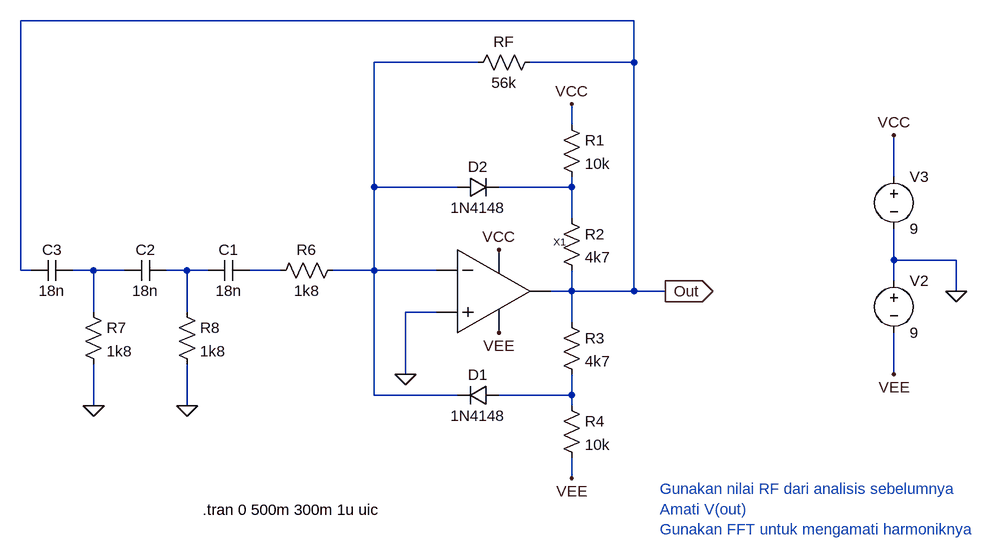
[diagram p0: schematic Perc-4-2-PhaseShifterIWithLimiter.asc]
Perc-4-2-PhaseShifterIWithLimiter.asc, the LTspice schematic file:
Version 4
SHEET 1 1076 680
WIRE 320 -128 -624 -128
WIRE 80 -64 -80 -64
WIRE 320 -64 320 -128
WIRE 320 -64 160 -64
WIRE 224 32 224 0
WIRE 720 112 720 48
WIRE -80 128 -80 -64
WIRE 48 128 -80 128
WIRE 224 128 224 112
WIRE 224 128 112 128
WIRE 224 176 224 128
WIRE 720 240 720 192
WIRE 816 240 720 240
WIRE -624 256 -624 -128
WIRE -608 256 -624 256
WIRE -512 256 -544 256
WIRE -464 256 -512 256
WIRE -368 256 -400 256
WIRE -336 256 -368 256
WIRE -224 256 -272 256
WIRE -80 256 -80 128
WIRE -80 256 -144 256
WIRE 16 256 -80 256
WIRE 720 272 720 240
WIRE 224 288 224 256
WIRE 224 288 192 288
WIRE 320 288 320 -64
WIRE 320 288 224 288
WIRE 368 288 320 288
WIRE 816 288 816 240
WIRE -512 320 -512 256
WIRE -368 320 -368 256
WIRE 16 320 -32 320
WIRE 224 336 224 288
WIRE -32 416 -32 320
WIRE 720 416 720 352
WIRE -80 448 -80 256
WIRE 48 448 -80 448
WIRE 224 448 224 416
WIRE 224 448 112 448
WIRE -512 464 -512 400
WIRE -368 464 -368 400
WIRE 224 464 224 448
WIRE 224 576 224 544
FLAG 224 0 VCC
FLAG 224 576 VEE
FLAG -32 416 0
FLAG 720 416 VEE
FLAG 112 352 VEE
FLAG 720 48 VCC
FLAG 816 288 0
FLAG 112 224 VCC
FLAG -512 464 0
FLAG -368 464 0
FLAG 368 288 Out
IOPIN 368 288 Out
SYMBOL res 208 16 R0
SYMATTR InstName R1
SYMATTR Value 10k
SYMBOL res 208 160 R0
SYMATTR InstName R2
SYMATTR Value 4k7
SYMBOL res 208 320 R0
SYMATTR InstName R3
SYMATTR Value 4k7
SYMBOL res 208 448 R0
SYMATTR InstName R4
SYMATTR Value 10k
SYMBOL res 176 -80 R90
WINDOW 0 0 56 VBottom 2
WINDOW 3 32 56 VTop 2
SYMATTR InstName RF
SYMATTR Value 56k
SYMBOL res -128 240 R90
WINDOW 0 0 56 VBottom 2
WINDOW 3 32 56 VTop 2
SYMATTR InstName R6
SYMATTR Value 1k8
SYMBOL diode 112 432 R90
WINDOW 0 0 32 VBottom 2
WINDOW 3 32 32 VTop 2
SYMATTR InstName D1
SYMATTR Value 1N4148
SYMBOL diode 48 112 M90
WINDOW 0 0 32 VBottom 2
WINDOW 3 32 32 VTop 2
SYMATTR InstName D2
SYMATTR Value 1N4148
SYMBOL voltage 720 256 R0
WINDOW 123 0 0 Left 0
WINDOW 39 0 0 Left 0
SYMATTR InstName V2
SYMATTR Value 9
SYMBOL voltage 720 96 R0
WINDOW 123 0 0 Left 0
WINDOW 39 0 0 Left 0
SYMATTR InstName V3
SYMATTR Value 9
SYMBOL cap -272 240 R90
WINDOW 0 0 32 VBottom 2
WINDOW 3 32 32 VTop 2
SYMATTR InstName C1
SYMATTR Value 18n
SYMBOL cap -400 240 R90
WINDOW 0 0 32 VBottom 2
WINDOW 3 32 32 VTop 2
SYMATTR InstName C2
SYMATTR Value 18n
SYMBOL cap -544 240 R90
WINDOW 0 0 32 VBottom 2
WINDOW 3 32 32 VTop 2
SYMATTR InstName C3
SYMATTR Value 18n
SYMBOL res -528 304 R0
SYMATTR InstName R7
SYMATTR Value 1k8
SYMBOL res -384 304 R0
SYMATTR InstName R8
SYMATTR Value 1k8
SYMBOL Opampku 96 288 R0
SYMATTR InstName X1
TEXT -344 624 Left 2 !.tran 0 500m 300m 1u uic
TEXT 360 592 Left 2 ;Gunakan nilai RF dari analisis sebelumnya\nAmati V(out)\nGunakan FFT untuk mengamati harmoniknya

The netlist it stands for:
* Perc-4-2-PhaseShifterIWithLimiter.asc
R1 VCC N002 10k
R2 N002 Out 4k7
R3 Out N006 4k7
R4 N006 VEE 10k
RF Out N001 56k
R6 N001 N005 1k8
D1 N006 N001 1N4148
D2 N001 N002 1N4148
V2 0 VEE 9
V3 VCC 0 9
C1 N005 N004 18n
C2 N004 N003 18n
C3 N003 Out 18n
R7 N003 0 1k8
R8 N004 0 1k8
XX1 N001 0 VCC VEE Out Opampku  ; pins inn inp vp vn out
.model D D
.lib standard.dio
.tran 0 500m 300m 1u uic
* Gunakan nilai RF dari analisis sebelumnya
* Amati V(out)
* Gunakan FFT untuk mengamati harmoniknya
.backanno
.end